# EAGLE design Un_51_old (EAGLE 6.5.0)
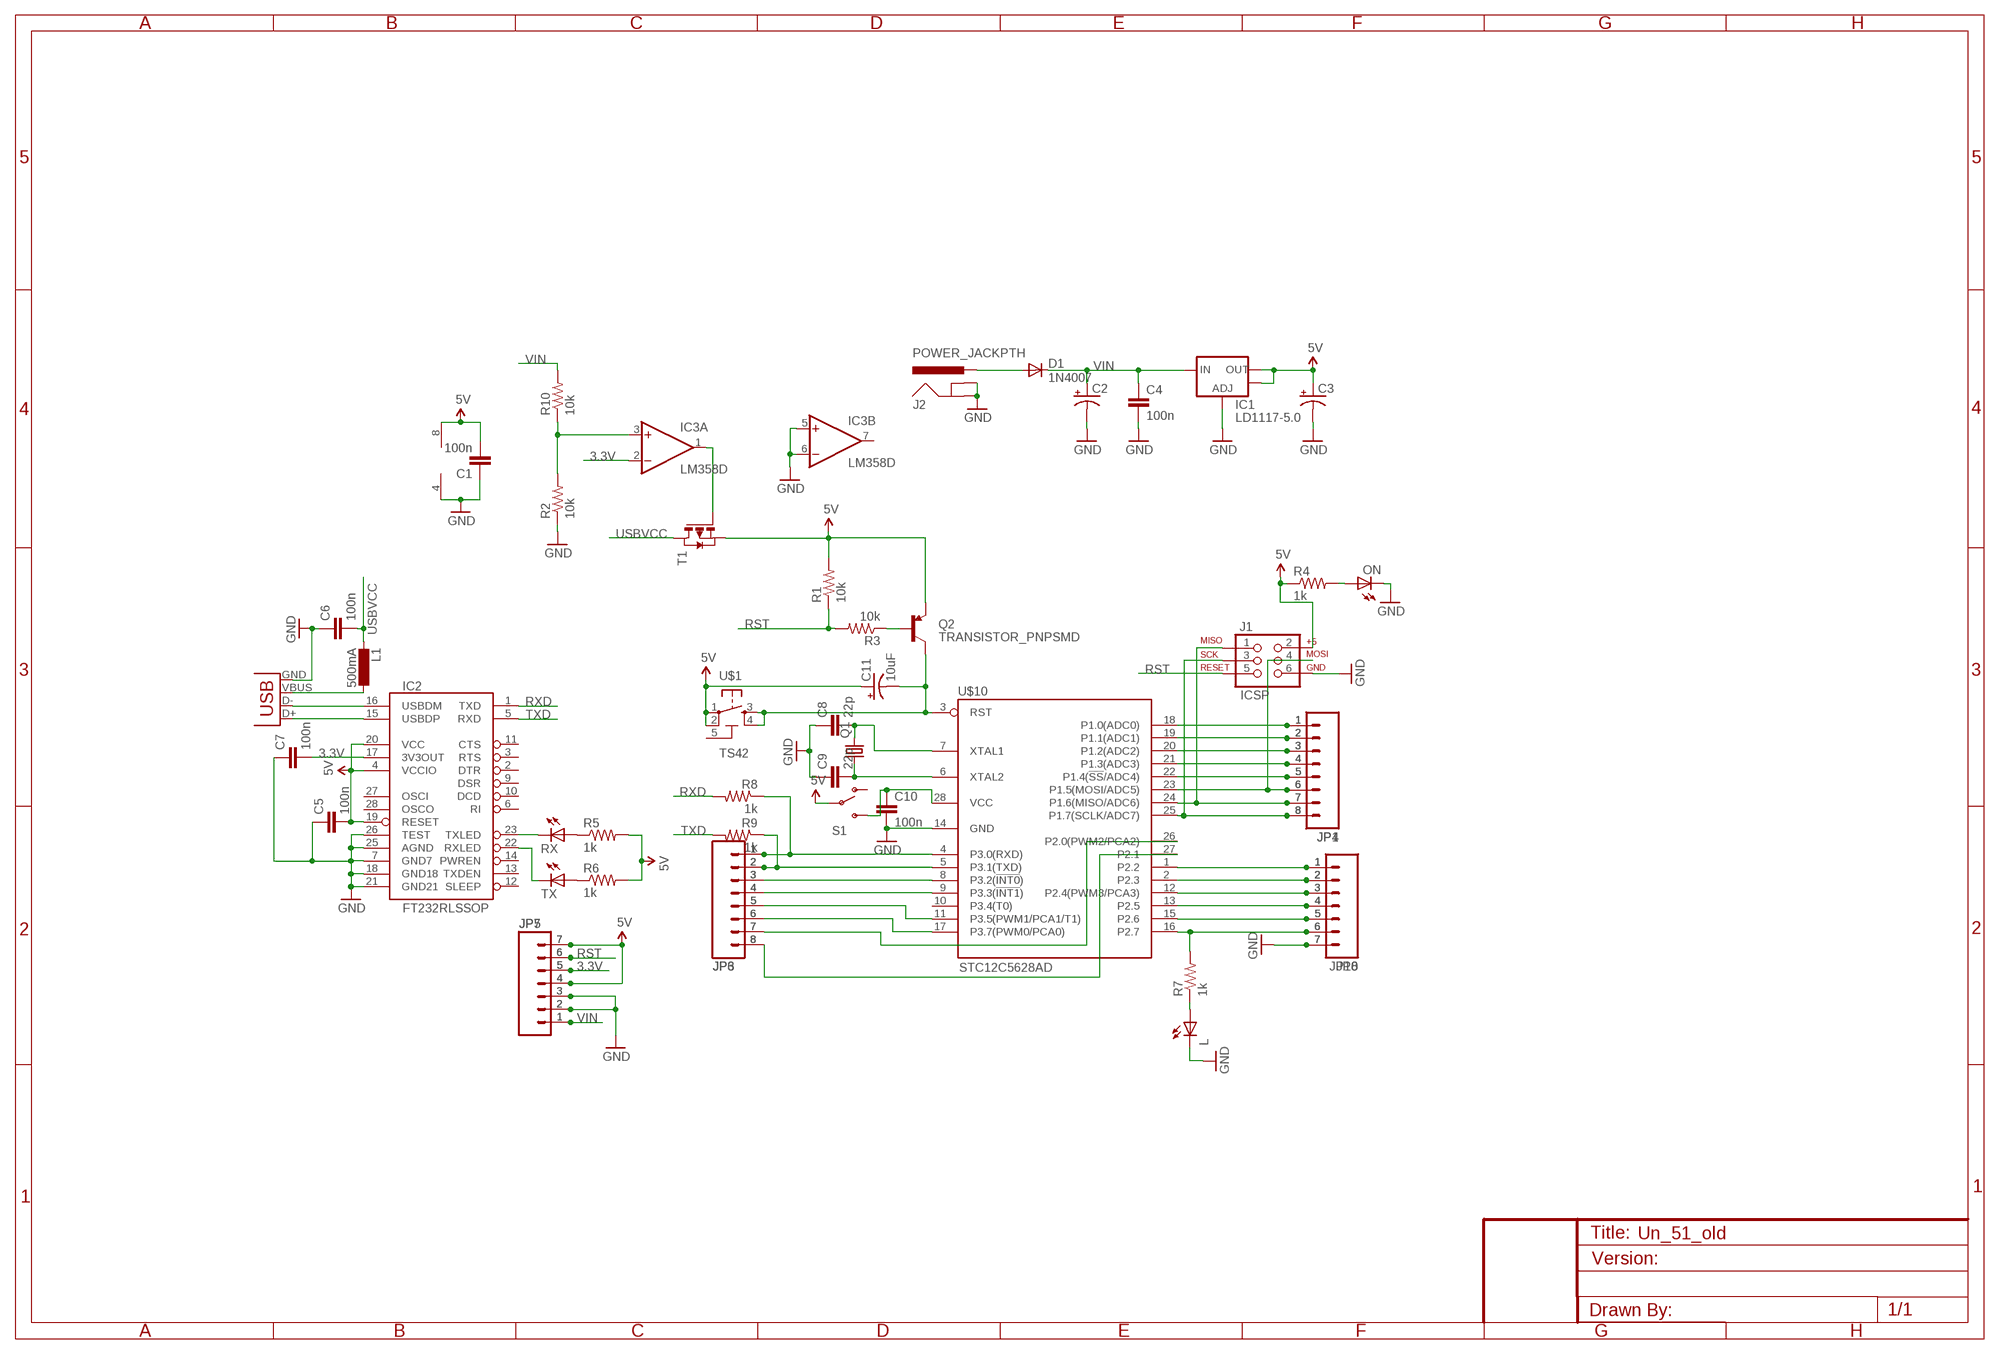
[diagram p0: schematic, sheet 1]

## Parts
C1  100n  CAP0603-CAP  [0603-CAP]
C2  CAP_POLD  [PANASONIC_D]
C3  CAP_POLD  [PANASONIC_D]
C4  100n  CAP0603-CAP  [0603-CAP]
C5  100n  CAP0603-CAP  [0603-CAP]
C6  100n  CAP0603-CAP  [0603-CAP]
C7  100n  CAP0603-CAP  [0603-CAP]
C8  22p  CAP0805  [0805]
C9  22p  CAP0805  [0805]
C10  100n  CAP0603-CAP  [0603-CAP]
C11  10uF  CAP_POL1206  [EIA3216]
D1  1N4007  DIODE-SMB  [SMB]
IC1  LD1117-5.0  V_REG_LM1117SOT223  [SOT223]
IC2  FT232RLSSOP  [SSOP28DB]
IC3  LM358D  [SO08]
J1  ICSP  AVR_SPI_PRG_6PTH  [2X3]
J2  POWER_JACKPTH  [POWER_JACK_PTH]
JP1  M081X08  [1X08]
JP3  M08  [1X08]
JP4  M081X08  [1X08]
JP5  M07  [1X07]
JP6  M08  [1X08]
JP7  M07  [1X07]
JP8  M07  [1X07]
JP10  M07  [1X07]
L  LED0805  [LED-0805]
L1  500mA  L-EUL1812  [L1812]
ON  LED0805  [LED-0805]
Q1  CRYSTALHC49US  [HC49US]
Q2  TRANSISTOR_PNPSMD  [SOT23-3]
R1  10k  RESISTOR0805-RES  [0805]
R2  10k  RESISTOR0805-RES  [0805]
R3  10k  RESISTOR0805-RES  [0805]
R4  1k  RESISTOR0805-RES  [0805]
R5  1k  RESISTOR0805-RES  [0805]
R6  1k  RESISTOR0805-RES  [0805]
R7  1k  RESISTOR0805-RES  [0805]
R8  1k  RESISTOR0805-RES  [0805]
R9  1k  RESISTOR0805-RES  [0805]
R10  10k  RESISTOR0805-RES  [0805]
RX  LED0805  [LED-0805]
S1  SWITCH-SPST  [SWITCH-SPDT2]
T1  PMOSSOT23  [SOT-23]
TX  LED0805  [LED-0805]
U$1  TS42  [TS42]
U$10  STC12C5628AD  [SO-28W]
X1  USBPTH  [USB-B-PTH]

## Nets
3.3V: C7.2 IC2.17(3V3OUT) IC3.2(A:-IN) JP5.5 JP7.5
5V: C1.2 C3.+ C5.2 C11.A(+) IC1.2(OUT) IC1.4(OUT) IC2.4(VCCIO) IC2.19(RESET) IC2.20(VCC) IC3.8(P:V+) J1.2 JP5.4 JP5.7 JP7.4 JP7.7 Q2.2(E) R1.2 R4.1 R5.2 R6.2 S1.2(P) T1.2(S) U$1.1 U$1.2
A0: JP1.1 JP4.1 U$10.18(P1.0(ADC0))
GND [gnd]: C1.1 C2.- C3.- C4.2 C5.1 C6.1 C7.1 C8.1 C9.1 C10.2 IC1.1(ADJ) IC2.7(GND7) IC2.18(GND18) IC2.21(GND21) IC2.25(AGND) IC2.26(TEST) IC3.4(P:V-) IC3.5(B:+IN) IC3.6(B:-IN) J1.6 J2.GND J2.GNDBREAK JP5.2 JP5.3 JP7.2 JP7.3 JP8.7 JP10.7 L.2(C) ON.2(C) R2.1 U$10.14(GND) X1.GND
IO0: JP3.1 JP6.1 R8.1 U$10.4(P3.0(RXD))
N$1: IC3.3(A:+IN) R2.2 R10.1
N$2: IC3.1(A:OUT) T1.3(G)
N$3: L1.1 X1.VBUS
N$4: D1.A J2.PWR
N$5: IC2.16(USBDM) X1.D-
N$6: IC2.15(USBDP) X1.D+
N$7: R5.1 RX.1(A)
N$8: R6.1 TX.1(A)
N$9: IC2.23(TXLED) RX.2(C)
N$10: IC2.22(RXLED) TX.2(C)
N$11: JP3.8 JP6.8 U$10.27(P2.1)
N$12: J1.1 JP1.7 JP4.7 U$10.24(P1.6(MISO/ADC6))
N$13: J1.3 JP1.8 JP4.8 U$10.25(P1.7(SCLK/ADC7))
N$14: L.1(A) R7.1
N$15: C10.1 S1.3(S) U$10.28(VCC)
N$16: JP8.1 JP10.1 U$10.1(P2.2)
N$17: JP8.2 JP10.2 U$10.2(P2.3)
N$18: JP8.3 JP10.3 U$10.12(P2.4(PWM3/PCA3))
N$19: JP8.4 JP10.4 U$10.13(P2.5)
N$21: Q2.1(B) R3.1
N$22: C11.C(-) Q2.3(C) U$1.3 U$1.4 U$10.3(RST)
N$23: JP3.2 JP6.2 R9.1 U$10.5(P3.1(TXD))
N$24: JP3.3 JP6.3 U$10.8(P3.2(!INT0!))
N$25: JP3.4 JP6.4 U$10.9(P3.3(!INT1!))
N$26: JP3.5 JP6.5 U$10.11(P3.5(PWM1/PCA1/T1))
N$27: JP3.6 JP6.6 U$10.17(P3.7(PWM0/PCA0))
N$28: JP3.7 JP6.7 U$10.26(P2.0(PWM2/PCA2))
N$29: JP8.6 JP10.6 R7.2 U$10.16(P2.7)
N$31: JP1.2 JP4.2 U$10.19(P1.1(ADC1))
N$32: JP1.3 JP4.3 U$10.20(P1.2(ADC2))
N$33: JP1.4 JP4.4 U$10.21(P1.3(ADC3))
N$34: ON.1(A) R4.2
N$39: C8.2 Q1.2 U$10.7(XTAL1)
N$40: C9.2 Q1.1 U$10.6(XTAL2)
RST: J1.5 JP5.6 JP7.6 R1.1 R3.2
RXD: IC2.1(TXD) R8.2
SCK: JP8.5 JP10.5 U$10.15(P2.6)
SCL: J1.4 JP1.6 JP4.6 U$10.23(P1.5(MOSI/ADC5))
SDA: JP1.5 JP4.5 U$10.22(P1.4(!SS!/ADC4))
TXD: IC2.5(RXD) R9.2
USBVCC: C6.2 L1.2 T1.1(D)
VIN: C2.+ C4.1 D1.C IC1.3(IN) JP5.1 JP7.1 R10.2
Unconnected: IC2.2(DTR) IC2.3(RTS) IC2.6(RI) IC2.9(DSR) IC2.10(DCD) IC2.11(CTS) IC2.12(SLEEP) IC2.13(TXDEN) IC2.14(PWREN) IC2.27(OSCI) IC2.28(OSCO) IC3.7(B:OUT) S1.1(O) U$1.5 U$10.10(P3.4(T0))

## Library data of the parts
C1 C4-C10 = 1SparkFun:CAP: Capacitor Standard 0603 ceramic capacitor, and 0.1" leaded capacitor.
C2 C3 C11 = 2SparkFun:CAP_POL: Capacitor Polarized These are standard SMD and PTH capacitors. Normally 10uF, 47uF, and 100uF in electrolytic and tantalum varieties. Always verify the external diameter of the through hole cap, it varies with capacity, voltage, and manufacturer. The EIA devices should be standard.
D1 = diode:DIODE-: DIODE
IC1 = 1SparkFun:V_REG_LM1117: Voltage Regulator LM1117 Standard adjustable voltage regulator but in SMD form. Spark Fun Electronics SKU : COM-00595
IC2 = 1SparkFun:FT232RL: USB UART FT232RL 4th Generation USB UART (USB <-> Serial) Controller. Spark Fun Electronics SKU : COM-00650
IC3 = linear:LM358: OP AMP also LM158; LM258; LM2904 Source: http://cache.national.com/ds/LM/LM158.pdf
J1 = 1SparkFun:AVR_SPI_PRG_6: AVR ISP 6 Pin This is the reduced ISP connector for AVR programming. Common on Arduino. This footprint will take up less PCB space and can be used with a 10-pin to 6-pin adapter such as SKU: BOB-08508
J2 = 2SparkFun:POWER_JACK: Power Jack This is the standard 5.5mm barrel jack for power. The PTH is the most common, proven, reliable, footprint. All others are experimental. The Slot footprint only works if the mill layer is transmitted to the PCB fab house so be warned. Spark Fun Electronics SKU : PRT-00119. Mating wall wart : TOL-00298 (and others)
JP1 JP4 = 2SparkFun:M08: Header 8 Standard 8-pin 0.1" header. Use with straight break away headers (SKU : PRT-00116), right angle break away headers (PRT-00553), swiss pins (PRT-00743), machine pins (PRT-00117), and female headers (PRT-00115).
JP3 JP6 = 1SparkFun:M08: Header 8 Standard 8-pin 0.1" header. Use with straight break away headers (SKU : PRT-00116), right angle break away headers (PRT-00553), swiss pins (PRT-00743), machine pins (PRT-00117), and female headers (PRT-00115).
JP5 JP7 JP8 JP10 = 2SparkFun:M07: Header 7 Standard 7-pin 0.1" header. Use with straight break away headers (SKU : PRT-00116), right angle break away headers (PRT-00553), swiss pins (PRT-00743), machine pins (PRT-00117), and female headers (PRT-00115). NOTES ON THE VARIANTS LOCK and LOCK_LONGPADS... This footprint was designed to help hold the alignment of a through-hole component (i.e. 7-pin header) while soldering it into place. You may notice that each hole has been shifted either up or down by 0.005 of an inch from it's more standard position (which is usually a perfectly straight line). This slight alteration caused the pins (the squares in the middle) to touch the edges of the holes. Because they are alternating, it causes a "brace" to hold the header in place. 0.005 has proven to be the perfect amount of "off-center" position when using our standard breakaway headers. Although looks a little odd when you look at the bare footprint, once you have a header in there, the alteration is very hard to notice. Also, if you push a header all the way into place, it is covered up entirely on the bottom side. This idea of altering the position of holes to aid alignment will be further integrated into the Sparkfun Library for other footprints. It can help hold any component with 3 or more connection pins.
L ON RX TX = 1SparkFun:LED: LEDs Standard schematic elements and footprints for 5mm, 3mm, 1206, and 0603 sized LEDs. 5mm - Spark Fun Electronics SKU : COM-00529 (and others)
L1 = rcl:L-EU: INDUCTOR, European symbol
Q1 = 1SparkFun:CRYSTAL: Crystals Various standard crystals. Proven footprints. Spark Fun Electronics SKU : COM-00534
Q2 = 1SparkFun:TRANSISTOR_PNP
R1-R10 = 2SparkFun:RESISTOR: Resistor Basic schematic elements and footprints for 0603, 1206, and PTH resistors.
S1 = 2SparkFun:SWITCH-SPST: SPST Switch Simple slide switch. Spark Fun Electronics SKU : COM-00102
T1 = zetex:PMOSSOT23: MOS FET; OC_FARNELL: unknown; OC_NEWARK: unknown
U$1 = 2SparkFun:TS42
U$10 = 2SparkFun:STC12C5628AD
X1 = 1SparkFun:USB: USB Connectors USB-B-PTH is fully proven SKU : PRT-00139 USB-miniB is fully proven SKU : PRT-00587 USB-A-PCB is untested. USB-A-H is throughly reviewed, but untested. Spark Fun Electronics SKU : PRT-00437 USB-B-SMT is throughly reviewed, but untested. Needs silkscreen touching up. USB-A-S has not been used/tested USB-MB-H has not been used/tested

## Net classes
0 default: width 0.254 mm, clearance 0.254 mm
1 power: width 0.61 mm, drill 0.61 mm, clearance 0.254 mm
2 gnd: width 0.305 mm, drill 0.559 mm, clearance 0.254 mm
3 usbvcc: width 0.508 mm, drill 0.61 mm, clearance 0.254 mm
4 aref: width 0.406 mm, drill 0.61 mm, clearance 0.254 mm

## Board
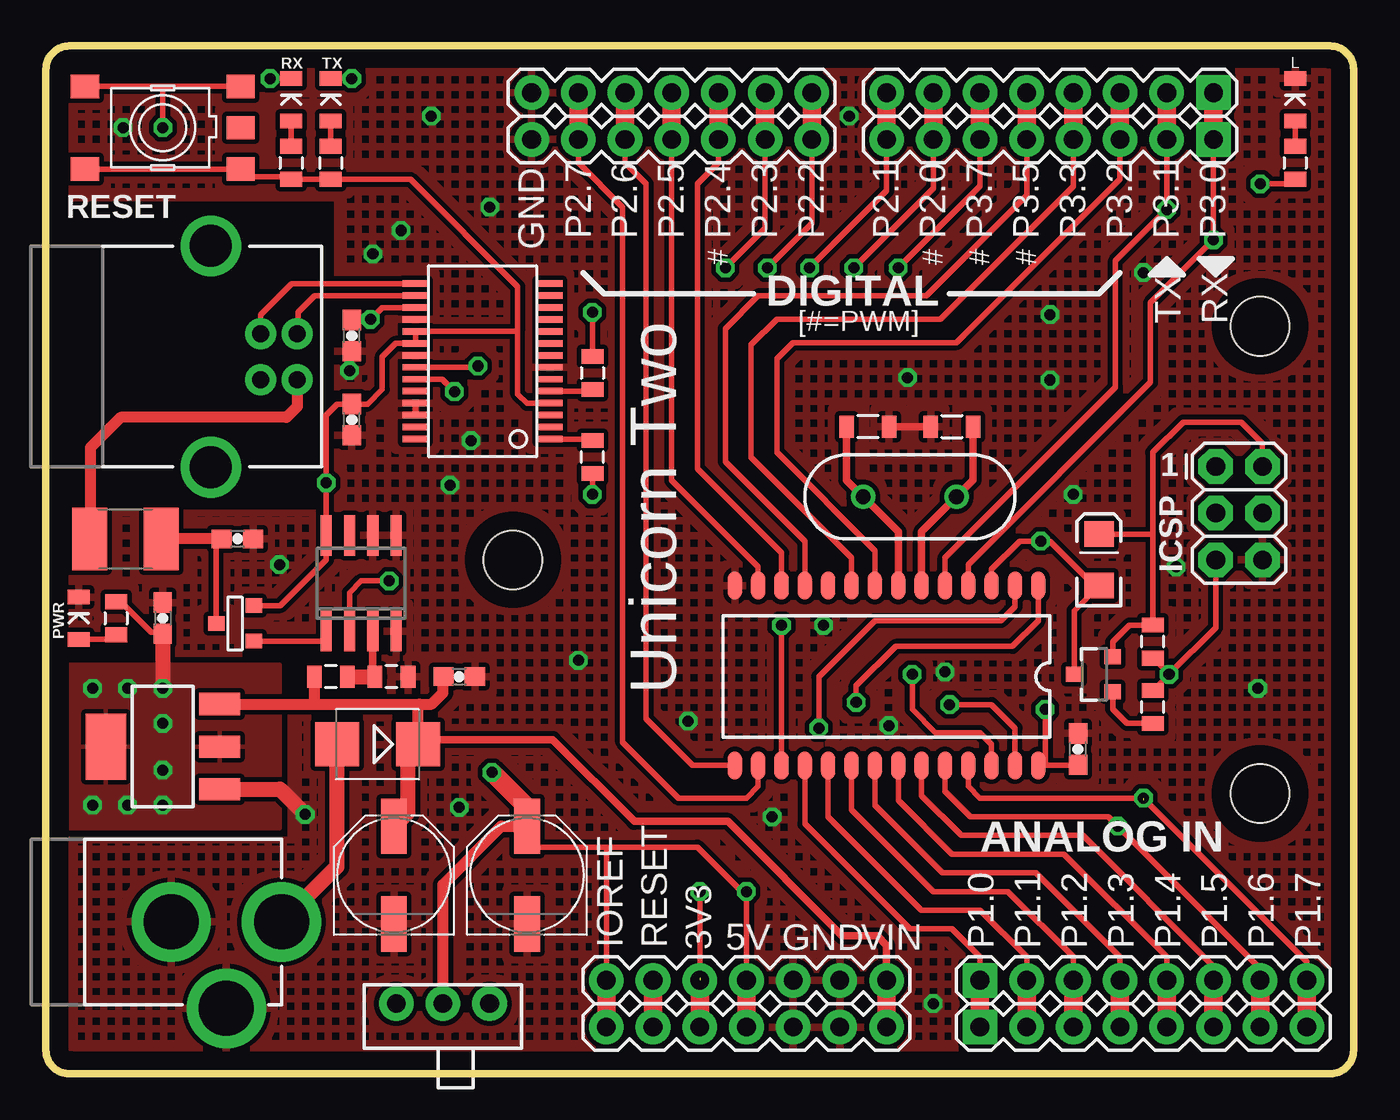
[diagram p1: board, top side]
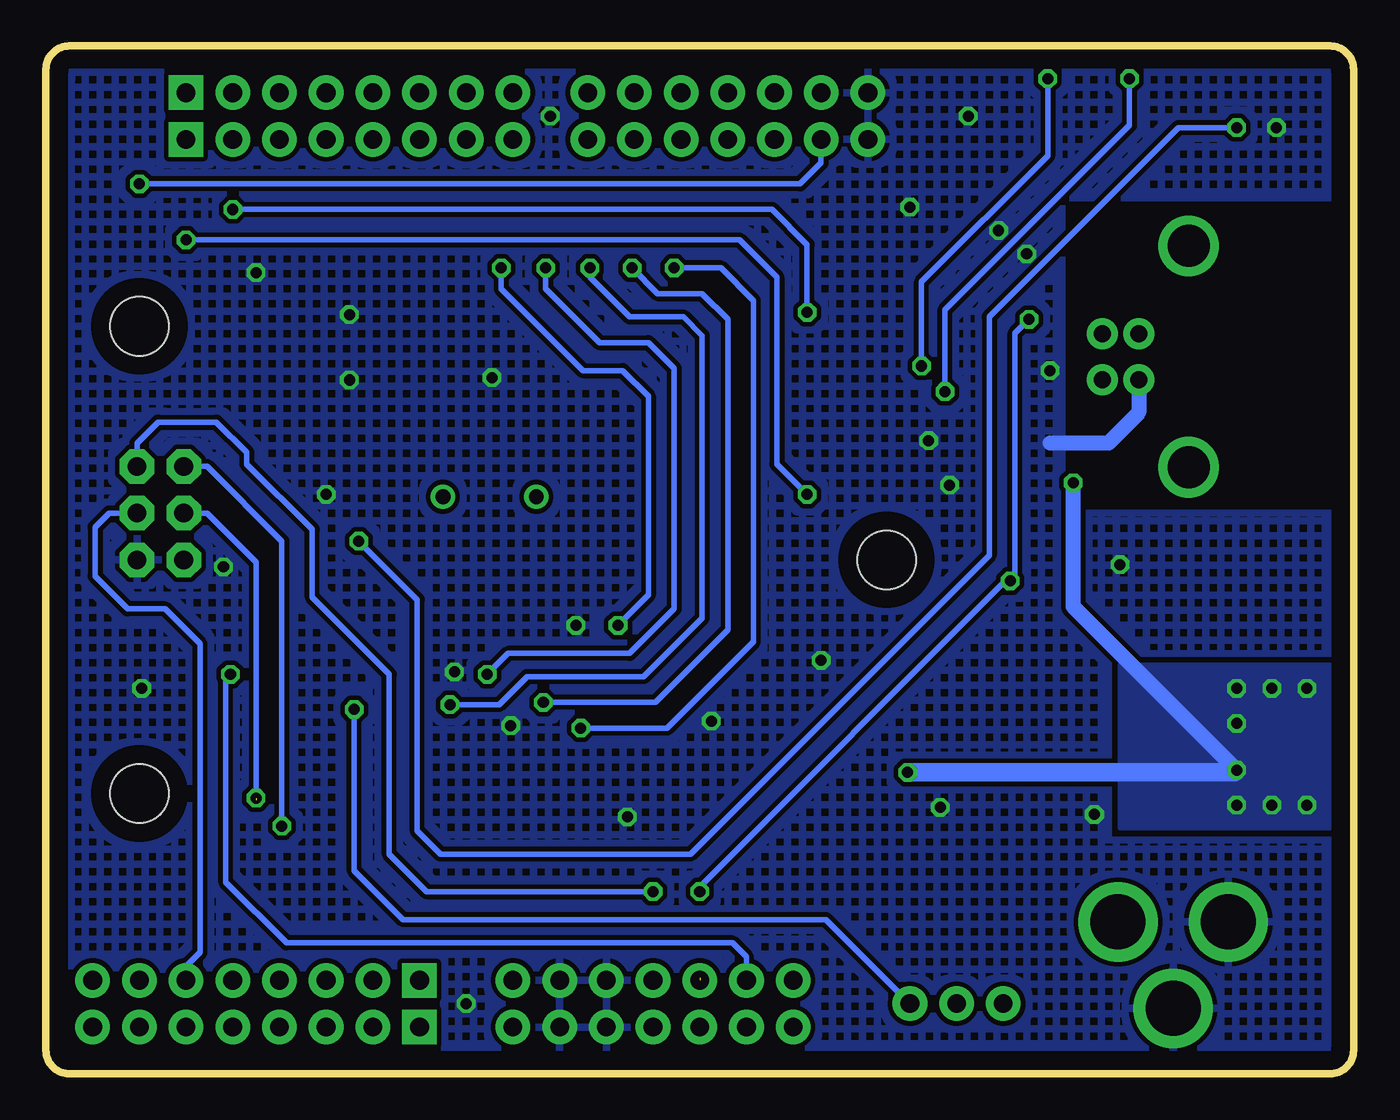
[diagram p2: board, bottom side, seen from below]

Size 71.12 x 55.88 mm. Coordinates in mm from the lower left corner, seen from the top.
Outline: 1.27,0 69.85,0 arc90 71.12,1.27 71.12,54.61 arc90 69.85,55.88 1.27,55.88 arc90 0,54.61 0,1.27 arc90 1.27,0
Copper layers (1*16): Top 0.035mm / dielectric 1.5mm / Bottom 0.035mm
Design rules "default": minimum track width 10mil, minimum drill 24mil, track to track 8mil, track to pad 8mil, pad to pad 8mil, via to via 8mil, smd to smd 8mil, copper to edge 40mil, drill to drill 8mil, minimum pad ring 10mil, minimum via ring 8mil, stop-mask expansion 4mil, vias tented up to drill 0mil, thermal gap 10mil
Holes 3.2 mm at 66.04,40.64 66.04,15.24 25.4,27.94

### Footprints (pad centres in the part's own frame; a part is rotated, then mirrored left to right if it is on the bottom)
0603-CAP = smd 1.1 x 1: 1 -0.85,0; 2 0.85,0
PANASONIC_D = smd 3 x 1.4: + 2.654,0; - -2.654,0
0805 = smd 0.8 x 1.2: 1 -1.154,0; 2 1.154,0
EIA3216 = smd 1.4 x 1.6: A 1.4,0; C -1.4,0
SMB = smd 2.4 x 2.4: A 2.2,0; C -2.2,0
SOT223 = smd 1.219 x 2.235: 1 -2.311,-3.099; 2 0,-3.099; 3 2.311,-3.099 | smd 3.6 x 2.2: 4 0,3.099
SSOP28DB = smd 0.348 x 1.397: 1 -4.225,-3.656; 2 -3.575,-3.656; 3 -2.925,-3.656; 4 -2.275,-3.656; 5 -1.625,-3.656; 6 -0.975,-3.656; 7 -0.325,-3.656; 8 0.325,-3.656; 9 0.975,-3.656; 10 1.625,-3.656; 11 2.275,-3.656; 12 2.925,-3.656; 13 3.575,-3.656; 14 4.225,-3.656; 15 4.225,3.656; 16 3.575,3.656; 17 2.925,3.656; 18 2.275,3.656; 19 1.625,3.656; 20 0.975,3.656; 21 0.325,3.656; 22 -0.325,3.656; 23 -0.975,3.656; 24 -1.625,3.656; 25 -2.275,3.656; 26 -2.925,3.656; 27 -3.575,3.656; 28 -4.225,3.656
SO08 = smd 0.6 x 2.2: 1 -1.905,-2.6; 2 -0.635,-2.6; 3 0.635,-2.6; 4 1.905,-2.6; 5 1.905,2.6; 6 0.635,2.6; 7 -0.635,2.6; 8 -1.905,2.6
2X3 = drill 1.016 pad 1.88 octagon: 1 0,0; 2 0,2.54; 3 2.54,0; 4 2.54,2.54; 5 5.08,0; 6 5.08,2.54
POWER_JACK_PTH = drill 2.997 pad 4.318: GND 0,7.7; GNDBREAK 4.7,10.7; PWR 0,13.7
1X08 = drill 1.016 pad 1.88 square: 1 0,0 | drill 1.016 pad 1.88: 2 2.54,0; 3 5.08,0; 4 7.62,0; 5 10.16,0; 6 12.7,0; 7 15.24,0; 8 17.78,0
1X07 = drill 1.016 pad 1.88: 1 0,0; 2 2.54,0; 3 5.08,0; 4 7.62,0; 5 10.16,0; 6 12.7,0; 7 15.24,0
LED-0805 = smd 0.8 x 1.2: 1 -1.154,0; 2 1.154,0
L1812 = smd 1.9 x 3.4: 1 -1.95,0; 2 1.95,0
HC49US = drill 0.813: 1 -2.54,0; 2 2.54,0
SOT23-3 = smd 0.8 x 0.9: 1 -0.95,-1; 2 0.95,-1; 3 0,1.1
0805' = smd 0.8 x 1.2: 1 -0.9,0; 2 0.9,0
SWITCH-SPDT2 = drill 1.016 pad 1.88: 1 0,2.54; 2 0,0; 3 0,-2.54
SOT-23 = smd 0.787 x 0.889: 1 0.025,-1.016; 2 -0.94,1.016; 3 0.991,1.016
TS42 = smd 1.524 x 1.27: 1 -4.229,2.25; 2 4.229,2.25; 3 -4.229,-2.25; 4 4.229,-2.25; 5 -4.229,-0.002
SO-28W = smd 0.762 x 1.524: 1 -8.255,-4.953; 2 -6.985,-4.953; 3 -5.715,-4.953; 4 -4.445,-4.953; 5 -3.175,-4.953; 6 -1.905,-4.953; 7 -0.635,-4.953; 8 0.635,-4.953; 9 1.905,-4.953; 10 3.175,-4.953; 11 4.445,-4.953; 12 5.715,-4.953; 13 6.985,-4.953; 14 8.255,-4.953; 15 8.255,4.826; 16 6.985,4.826; 17 5.715,4.826; 18 4.445,4.826; 19 3.175,4.826; 20 1.905,4.826; 21 0.635,4.826; 22 -0.635,4.826; 23 -1.905,4.826; 24 -3.175,4.826; 25 -4.445,4.826; 26 -5.715,4.826; 27 -6.985,4.826; 28 -8.255,4.826
USB-B-PTH = drill 0.914 pad 1.676: D+ 0,1.25; D- 1.981,1.25; GND 0,-1.25; VBUS 1.981,-1.25 | drill 2.286: P$1 -2.718,-6.02; P$2 -2.718,6.02

### Placement (x,y rotation side)
C1  6.35,24.77 270 top
C2  18.92,10.79 90 top
C3  26.16,10.79 90 top
C4  22.48,21.59 0 top
C5  16.64,35.56 90 top
C6  10.41,29.08 180 top
C7  16.64,40.13 90 top
C8  44.7,35.18 180 top
C9  49.28,35.18 0 top
C10  56.13,17.65 90 top
C11  57.28,27.94 90 top
D1  18.03,17.91 180 top
IC1  6.35,17.78 90 top
IC2  23.75,38.73 90 top
IC3  17.14,26.67 0 top
J1  63.63,33.02 270 top
J2  -0.89,8.26 270 top
JP1  50.8,5.08 0 top
JP3  63.5,53.34 180 top
JP4  50.8,2.54 0 top
JP5  45.72,2.54 180 top
JP6  63.5,50.8 180 top
JP7  45.72,5.08 180 top
JP8  41.66,50.8 180 top
JP10  41.66,53.34 180 top
L  67.94,52.96 90 top
L1  4.32,29.08 0 top
ON  1.78,24.77 90 top
Q1  46.99,31.37 180 top
Q2  57.02,21.72 90 top
R1  10k  [0805']  60.2,23.5 90 top
R2  10k  [0805']  18.8,21.59 180 top
R3  10k  [0805']  60.2,19.94 90 top
R4  1k  [0805']  3.81,24.77 270 top
R5  1k  [0805']  13.33,49.53 270 top
R6  1k  [0805']  15.49,49.53 270 top
R7  1k  [0805']  67.94,49.53 270 top
R8  1k  [0805']  29.72,33.53 90 top
R9  1k  [0805']  29.72,38.1 270 top
R10  10k  [0805']  15.49,21.59 180 top
RX  13.33,52.96 90 top
S1  21.59,3.81 90 top
T1  10.29,24.51 270 top
TX  15.49,52.96 90 top
U$1  6.35,51.44 180 top
U$10  45.72,21.59 180 top
X1  11.68,38.99 0 top

### Tracks (layer width: path | path; a pad name or v marks a point on that pad's centre or on a via)
3.3V  (via drill 0.6)  (1 unrouted)
  Top 0.305: 16.68,40.77 C7.2 16.68,41.02 v17.65,41.02 18.29,41.66 IC2.17 | 35.69,5.08 35.56,5.21 v35.56,9.91 | IC3.2 16.51,26.16 17.14,26.8 v18.67,26.8
  Top 1.016: JP7.5 JP5.5
  Bottom 0.305: v17.65,41.02 18.42,40.26 18.42,27.05 v18.67,26.8 18.92,26.8 35.56,10.16 v35.56,9.91
5V  (via drill 0.6)
  Top 0.305: R4.1 4.05,25.66 5.72,24 6.26,24 C1.2 | T1.2 12.75,25.45 15.24,27.94 IC3.8 v15.24,32.13 | 20.09,39.78 IC2.19 25.5,40.36 arc90 25.65,40.51 | 20.09,39.78 20.07,39.75 | 25.65,40.51 25.65,42.8 19.82,48.63 R6.2 15.37,48.76 15.37,48.77 15.23,48.63 R5.2 13.33,48.77 10.58,48.77 U$1.1 U$1.2 | IC2.4 27.39,36.45 26.16,36.45 25.65,36.96 25.65,40.51 | 60.2,29.34 60.2,33.78 61.85,35.43 65.02,35.43 66.17,34.29 J1.2 | 60.2,29.34 R1.2 58.94,24.39 58.02,23.48 Q2.2 | JP7.4 v38.1,9.91 37.85,9.91 35.43,12.32 30.48,12.32 | JP7.7 30.48,12.32 | v15.24,32.13 15.24,35.81 15.84,36.41 C5.2 17.49,36.41 18.29,37.21 18.29,38.99 19.01,39.71 IC2.20 20.09,39.78 | v15.24,32.13 15.24,31.5 | 30.48,12.32 26.16,12.32 | 26.16,12.32 26.03,12.32 | C3.+ 26.16,12.32 | C11.A 60.19,29.34 60.2,29.34
  Top 0.61: S1.2 21.59,10.29 24.77,13.46 26.15,13.46 C3.+
  Top 0.813: C1.2 v6.35,20.95 | C3.+ 26.16,12.83
  Top 1.016: JP7.4 JP5.4 | JP5.7 JP7.7 | C3.+ 26.16,14.48 v24.26,16.38
  Bottom 0.305: J1.2 66.17,34.29 65.02,35.43 61.85,35.43 60.2,33.78 60.2,33.15 56.64,29.59 56.64,25.91 52.45,21.72 52.45,11.94 50.42,9.91 v38.1,9.91
  Bottom 0.813: v6.35,16.51 15.24,25.4 v15.24,32.13
  Bottom 1.016: v24.26,16.38 6.48,16.38 v6.35,16.51
  other vias: 2.54,20.95 4.44,20.95 6.35,19.05 6.35,14.61 4.44,14.61 2.54,14.61
  pour Bottom: 1.27,22.23 12.7,22.23 12.7,13.34 1.27,13.34
  pour Top: 1.27,13.34 12.7,13.34 12.7,22.23 1.27,22.23
A0
  Top 0.305: U$10.18 41.28,13.59 46.99,7.87 49.28,7.87 50.8,6.35 JP1.1
  Top 1.016: JP1.1 JP4.1
GND  (via drill 0.6)
  Top 0.305: IC2.25 IC2.26 | v16.51,38.23 16.51,39.12 16.64,39.24
  Top 0.406: C8.1 C9.1
  Top 0.813: IC1.1 12.72,15.47 v14.1,14.1
  Bottom 0.813: X1.GND 11.68,35.94 13.33,34.29 16.51,34.29
  other vias: 17.78,44.58 22.48,14.48 39.5,13.97 48.26,3.81 54.61,37.72 21.97,32 28.96,22.48 23.11,34.42 20.95,52.07 54.61,41.27 55.88,31.5 24.13,47.12 65.91,20.95 34.92,19.18 48.89,21.84 46.86,37.85 12.7,27.69 19.3,45.85 4.19,51.44 43.69,52.07 59.69,43.56 42.29,24.38 45.85,18.92 61.47,27.56
  pour Top (hatched): 0,55.88 71.12,55.88 71.12,0 0,0 0,12.7 13.33,12.7 13.33,22.86 0,22.86 0,30.48 15.88,30.48 15.88,47.62 0,47.62
  pour Bottom (hatched): 0,55.88 71.12,55.88 71.12,0 0,0 0,12.7 13.33,12.7 13.33,22.86 0,22.86 0,30.48 15.88,30.48 15.88,47.62 0,47.62
IO0  (via drill 0.6)
  Top 0.305: U$10.4 50.17,27.69 60.07,37.59 60.07,41.91 v63.5,45.34 JP6.1 | v29.72,31.5 R8.1
  Top 1.016: JP3.1 JP6.1
  Bottom 0.305: v63.5,45.34 33.4,45.34 31.37,43.31 31.37,33.15 v29.72,31.5
N$1
  Top 0.406: IC3.3 17.78,21.71 R2.2
  Top 0.813: R10.1 R2.2
N$2
  Top 0.305: T1.3 15.34,23.52 15.37,23.5 15.37,23.94 IC3.1
N$3
  Top 0.61: X1.VBUS 13.67,36.27 13.08,35.69 4.06,35.69 2.41,34.04 2.41,29.13 L1.1
N$4
  Top 0.813: D1.A 15.83,11.25 15.81,11.25 J2.PWR
N$5
  Top 0.305: IC2.16 14.62,42.31 13.72,41.4 13.72,40.29 X1.D-
N$6
  Top 0.305: IC2.15 13.37,42.96 11.68,41.27 X1.D+
N$7
  Top 0.305: RX.1 R5.1
N$8
  Top 0.305: R6.1 TX.1
N$9  (via drill 0.6)
  Top 0.305: RX.2 12.2,54.11 v12.19,54.1 | IC2.23 21.55,37.76 v22.22,37.08
  Bottom 0.305: v12.19,54.1 12.19,51.56 22.22,41.53 v22.22,37.08
N$10  (via drill 0.6)
  Top 0.305: TX.2 16.5,54.11 v16.64,54.1 | IC2.22 23.42,38.41 v23.5,38.48
  Bottom 0.305: v16.64,54.1 16.64,49.91 23.5,43.05 v23.5,38.48
N$11  (via drill 0.6)
  Top 0.305: JP6.8 45.72,48.01 v41.53,43.81 | v49.15,20.07 51.44,20.07 52.7,18.8 U$10.27
  Top 1.016: JP3.8 JP6.8
  Bottom 0.305: v41.53,43.81 41.53,43.31 39.37,41.15 36.45,41.15 35.43,40.13 35.43,24.77 38.61,21.59 44.96,21.59 46.48,20.07 v49.15,20.07
N$12  (via drill 0.6)
  Top 0.305: U$10.24 48.89,15.37 50.29,13.97 57.78,13.97 v58.29,13.46 66.04,5.71 JP1.7
  Top 1.016: JP1.7 JP4.7
  Bottom 0.305: J1.1 62.36,33.02 58.29,28.96 v58.29,13.46
N$13  (via drill 0.6)  (1 unrouted)
  Top 0.305: U$10.25 50.17,15.62 50.8,14.99 v59.69,14.99 68.58,6.1 JP1.8
  Top 1.016: JP1.8 JP4.8
  Bottom 0.305: J1.3 62.36,30.48 59.69,27.81 59.69,14.86
N$14
  Top 0.305: L.1 R7.1
N$15  (via drill 0.6)
  Top 0.305: C10.1 56.13,16.76 U$10.28 54.36,16.76 v54.36,19.81
  Bottom 0.305: v54.36,19.81 54.36,11.05 51.69,8.38 28.7,8.38 S1.3
N$16  (via drill 0.6)
  Top 0.305: JP8.1 41.66,46.23 v39.24,43.81 | U$10.1 53.97,24.64 52.58,23.24 46.23,23.24 44.07,21.08 v44.07,20.19
  Top 1.016: JP10.1 JP8.1
  Bottom 0.305: v39.24,43.81 37.85,42.42 35.43,42.42 34.04,41.02 34.04,24.13 37.97,20.19 v44.07,20.19
N$17  (via drill 0.6)
  Top 0.305: JP8.2 39.12,45.97 v36.96,43.81 | U$10.2 52.7,25.4 51.94,24.64 45.08,24.64 42.04,21.59 v42.04,18.8
  Top 1.016: JP8.2 JP10.2
  Bottom 0.305: v42.04,18.8 37.34,18.8 32.64,23.5 32.64,42.04 34.42,43.81 v36.96,43.81
N$18
  Top 0.305: U$10.12 40,28.32 35.43,32.89 35.43,48.39 36.58,49.53 JP8.3
  Top 1.016: JP10.3 JP8.3
N$19
  Top 0.305: JP8.4 34.04,32.26 38.73,27.56 U$10.13
  Top 1.016: JP10.4 JP8.4
N$21
  Top 0.305: Q2.1 58.02,19.83 58.8,19.05 60.19,19.05 R3.1
N$22  (via drill 0.6)
  Top 0.305: U$10.3 51.44,27.43 52.96,28.96 v54.1,28.96 54.61,28.96 57.03,26.54 C11.C 55.92,25.19 Q2.3 | U$1.3 6.35,53.69 | 6.35,53.69 v6.35,51.44 | U$1.4 6.35,53.69
  Bottom 0.305: v6.35,51.44 9.53,51.44 19.81,41.15 19.81,28.19 36.07,11.94 49.66,11.94 50.93,13.21 50.93,25.78 v54.1,28.96
N$23  (via drill 0.6)
  Top 0.305: U$10.5 48.89,28.07 58.17,37.34 58.17,44.2 v60.96,46.99 JP6.2 | v29.72,41.4 R9.1
  Top 1.016: JP3.2 JP6.2
  Bottom 0.305: v60.96,46.99 31.62,46.99 29.72,45.09 v29.72,41.4
N$24
  Top 0.305: U$10.8 45.08,28.45 39.75,33.78 39.75,38.86 40.64,39.75 49.53,39.75 58.42,48.64 JP6.3
  Top 1.016: JP3.3 JP6.3
N$25
  Top 0.305: JP6.4 55.88,48.26 48.64,41.02 39.75,41.02 38.35,39.62 38.35,33.53 43.81,28.07 U$10.9
  Top 1.016: JP3.4 JP6.4
N$26
  Top 0.305: U$10.11 41.28,28.96 36.96,33.27 36.96,40.51 38.73,42.29 47.88,42.29 53.34,47.75 JP6.5
  Top 1.016: JP3.5 JP6.5
N$27  (via drill 0.6)
  Top 0.305: U$10.17 v40,24.38 | JP6.6 50.8,48.26 v46.36,43.81
  Top 1.016: JP3.6 JP6.6
  Bottom 0.305: v46.36,43.81 46.36,42.67 41.91,38.23 39.75,38.23 38.35,36.83 38.35,26.04 v40,24.38
N$28  (via drill 0.6)
  Top 0.305: JP6.7 48.26,48.13 v43.94,43.81 | U$10.26 51.44,17.91 50.8,18.54 48.39,18.54 47.12,19.81 v47.12,21.72
  Top 1.016: JP3.7 JP6.7
  Bottom 0.305: v43.94,43.81 43.94,42.67 41.02,39.75 38.35,39.75 36.96,38.35 36.96,25.27 39.37,22.86 45.97,22.86 v47.12,21.72
N$29  (via drill 0.6)
  Top 0.305: U$10.16 38.73,15.62 38.1,14.99 34.42,14.99 31.37,18.03 31.37,47.12 28.96,49.53 JP8.6 | v66.04,48.39 67.7,48.39 R7.2
  Top 1.016: JP10.6 JP8.6
  Bottom 0.305: JP8.6 28.96,49.53 30.1,48.39 v66.04,48.39
N$31
  Top 0.305: U$10.19 42.55,13.97 47.62,8.89 50.8,8.89 53.34,6.35 JP1.2
  Top 1.016: JP4.2 JP1.2
N$32
  Top 0.305: U$10.20 43.81,14.35 48.26,9.91 52.32,9.91 55.88,6.35 JP1.3
  Top 1.016: JP1.3 JP4.3
N$33
  Top 0.305: U$10.21 45.08,14.61 48.77,10.92 53.85,10.92 58.42,6.35 JP1.4
  Top 1.016: JP4.4 JP1.4
N$34
  Top 0.305: ON.1 3.56,23.61 R4.2
N$39
  Top 0.406: U$10.7 46.36,29.46 Q1.2 43.55,32.27 C8.2
N$40
  Top 0.406: U$10.6 47.62,29.46 Q1.1 50.43,32.27 C9.2
RST  (via drill 0.6)
  Top 0.305: R1.1 60.46,22.59 60.46,22.34 v61.09,21.72 | R3.2 60.46,20.84 60.46,21.09 v61.09,21.72 | v61.09,21.72 63.63,24.26 J1.5
  Top 1.016: JP5.6 JP7.6
  Bottom 0.305: JP7.6 33.02,6.35 33.78,7.11 58.04,7.11 61.34,10.41 61.34,21.46 v61.09,21.72
RXD
  Top 0.305: IC2.1 29.62,34.51 29.72,34.42 R8.2
SCK
  Top 0.305: JP8.5 31.5,49.53 32.64,48.39 32.64,19.3 35.18,16.76 U$10.15
  Top 1.016: JP10.5 JP8.5
SCL
  Top 0.305: U$10.23 47.62,15.11 49.78,12.95 56.39,12.95 63.5,5.84 JP1.6
  Top 1.016: JP1.6 JP4.6
  Bottom 0.305: J1.4 67.69,30.48 68.45,29.72 68.45,27.05 66.68,25.27 64.64,25.27 62.74,23.37 62.74,6.6 63.5,5.84 JP1.6
SDA
  Top 0.305: U$10.22 46.36,14.86 49.28,11.94 55.37,11.94 60.96,6.35 JP1.5
  Top 1.016: JP1.5 JP4.5
TXD
  Top 0.305: IC2.5 29.63,37.11 R9.2
USBVCC
  Top 0.305: T1.1 9.27,28.66 C6.2
  Top 0.61: C6.2 L1.2
VIN
  Top 0.406: 19.69,14.21 19.69,17.53 20.32,18.16 | JP7.1 45.72,6.99 45.21,7.49 43.31,7.49 37.08,13.72 32,13.72 27.56,18.16 20.49,18.16 D1.C
  Top 0.61: IC1.3 14.73,20.09 | R10.2 14.59,20.23 14.73,20.09 | 14.73,20.09 20.32,20.09 | 20.32,20.09 20.98,20.09 21.59,20.7 21.59,21.55 C4.1 | 20.32,20.09 20.23,20 D1.C 19.81,17.91 19.69,17.78
  Top 0.813: C2.+ 19.69,14.21 19.69,17.78
  Top 1.016: JP7.1 JP5.1

### Text on the board
tPlace: P2.6 | P2.5 | P2.4 | P2.3 | P2.2 | P2.1 | P2.0 | P3.7 | P3.5 | P3.3 | P3.2 | P3.1 | P3.0 | Unicorn Two
tNames: RX | TX | P2.7 | GND | RESET | # | # | # | # | DIGITAL | TX | RX | [#=PWM] | 1 | ICSP | PWR | ANALOG IN | IOREF | RESET | 3V3 | 5V | GND | VIN | P1.0 | P1.1 | P1.2 | P1.3 | P1.4 | P1.5 | P1.6 | P1.7